# Altium schematic sheet PWR.SchDoc
size A4; SheetNumber: 2; SheetTotal: 2
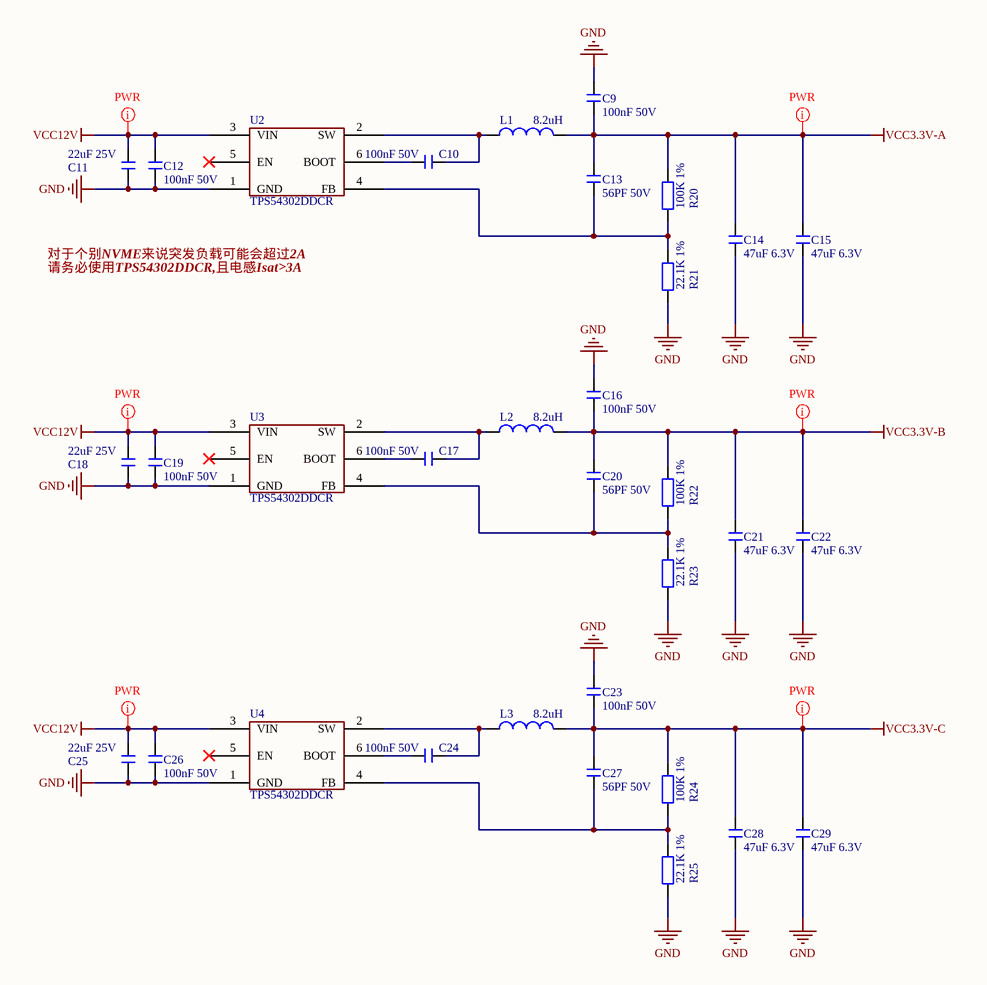
[diagram p0: PWR.SchDoc]

## Parts
C9  100nF 50V  [C0402_L]
C10  100nF 50V  [C0402_L]
C11  22uF 25V  [C0805_L]
C12  100nF 50V  [C0402_L]
C13  56PF 50V  [C0402_L]
C14  47uF 6.3V  [C0805_L]
C15  47uF 6.3V  [C0805_L]
C16  100nF 50V  [C0402_L]
C17  100nF 50V  [C0402_L]
C18  22uF 25V  [C0805_L]
C19  100nF 50V  [C0402_L]
C20  56PF 50V  [C0402_L]
C21  47uF 6.3V  [C0805_L]
C22  47uF 6.3V  [C0805_L]
C23  100nF 50V  [C0402_L]
C24  100nF 50V  [C0402_L]
C25  22uF 25V  [C0805_L]
C26  100nF 50V  [C0402_L]
C27  56PF 50V  [C0402_L]
C28  47uF 6.3V  [C0805_L]
C29  47uF 6.3V  [C0805_L]
L1  8.2uH  [L0630贴片电感]
L2  8.2uH  [L0630贴片电感]
L3  8.2uH  [L0630贴片电感]
R20  100K 1%  [R0402_L]
R21  22.1K 1%  [R0402_L]
R22  100K 1%  [R0402_L]
R23  22.1K 1%  [R0402_L]
R24  100K 1%  [R0402_L]
R25  22.1K 1%  [R0402_L]
U2  TPS54302DDCR  [SOT23-6L]
U3  TPS54302DDCR  [SOT23-6L]
U4  TPS54302DDCR  [SOT23-6L]

## Nets
GND: C9.2 C11.1 C12.1 C14.2 C15.2 C16.2 C18.1 C19.1 C21.2 C22.2 C23.2 C25.1 C26.1 C28.2 C29.2 R21.2 R23.2 R25.2 U2.1(GND) U3.1(GND) U4.1(GND)
VCC3.3V-A: C9.1 C13.2 C14.1 C15.1 L1.2 R20.1
VCC3.3V-B: C16.1 C20.2 C21.1 C22.1 L2.2 R22.1
VCC3.3V-C: C23.1 C27.2 C28.1 C29.1 L3.2 R24.1
VCC12V: C11.2 C12.2 C18.2 C19.2 C25.2 C26.2 U2.3(VIN) U3.3(VIN) U4.3(VIN)
NetC10_1: C10.1 U2.6(BOOT)
NetC10_2: C10.2 L1.1 U2.2(SW)
NetC13_1: C13.1 R20.2 R21.1 U2.4(FB)
NetC17_1: C17.1 U3.6(BOOT)
NetC17_2: C17.2 L2.1 U3.2(SW)
NetC20_1: C20.1 R22.2 R23.1 U3.4(FB)
NetC24_1: C24.1 U4.6(BOOT)
NetC24_2: C24.2 L3.1 U4.2(SW)
NetC27_1: C27.1 R24.2 R25.1 U4.4(FB)

Not connected (* = marked no-connect by the designer): U2 5(EN)*; U3 5(EN)*; U4 5(EN)*

## Layout directives
net class PWR: VCC3.3V-A, VCC3.3V-B, VCC3.3V-C, VCC12V

## Notes on the sheet
- 对于个别NVME来说突发负载可能会超过2A
- 请务必使用TPS54302DDCR,且电感Isat>3A

## Library data of the parts
C9-C29 = C: 无极性贴片电容; 版权归属: 源创客; 材质: X7R; BOM名称: 无极性贴片电容; 学习资源: www.ooocke.com
L1-L3 = L: 小功率贴片电感; 版权归属: 源创客; BOM名称: 小功率贴片电感; 学习资源: www.ooocke.com
R20-R25 = R: 贴片电阻; 版权归属: 源创客; BOM名称: 贴片电阻; 学习资源: www.ooocke.com
U2-U4 = TPS54202DDCR: DCDC Convert